# Altium schematic sheet Linear_Actuators.SchDoc
size A
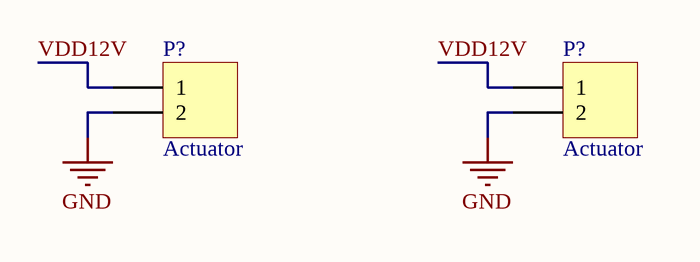
[diagram p0: Linear_Actuators.SchDoc]

## Parts
(Parts that share a designator on the sheet are numbered #1, #2 ... from top to bottom, then left to right.)
P?#1  Actuator  [HDR1X2]
P?#2  Actuator  [HDR1X2]

## Nets
GND: P?#1.2 P?#2.2
VDD12V: P?#1.1 P?#2.1

## Library data of the parts
P?#1 P?#2 = Header 2: Header, 2-Pin; LatestRevisionDate: 17-Jul-2002; LatestRevisionNote: Re-released for DXP Platform.; Publisher: Altium Limited